# EAGLE schematic Additional cascades (may be useful) (EAGLE 9.5.1)
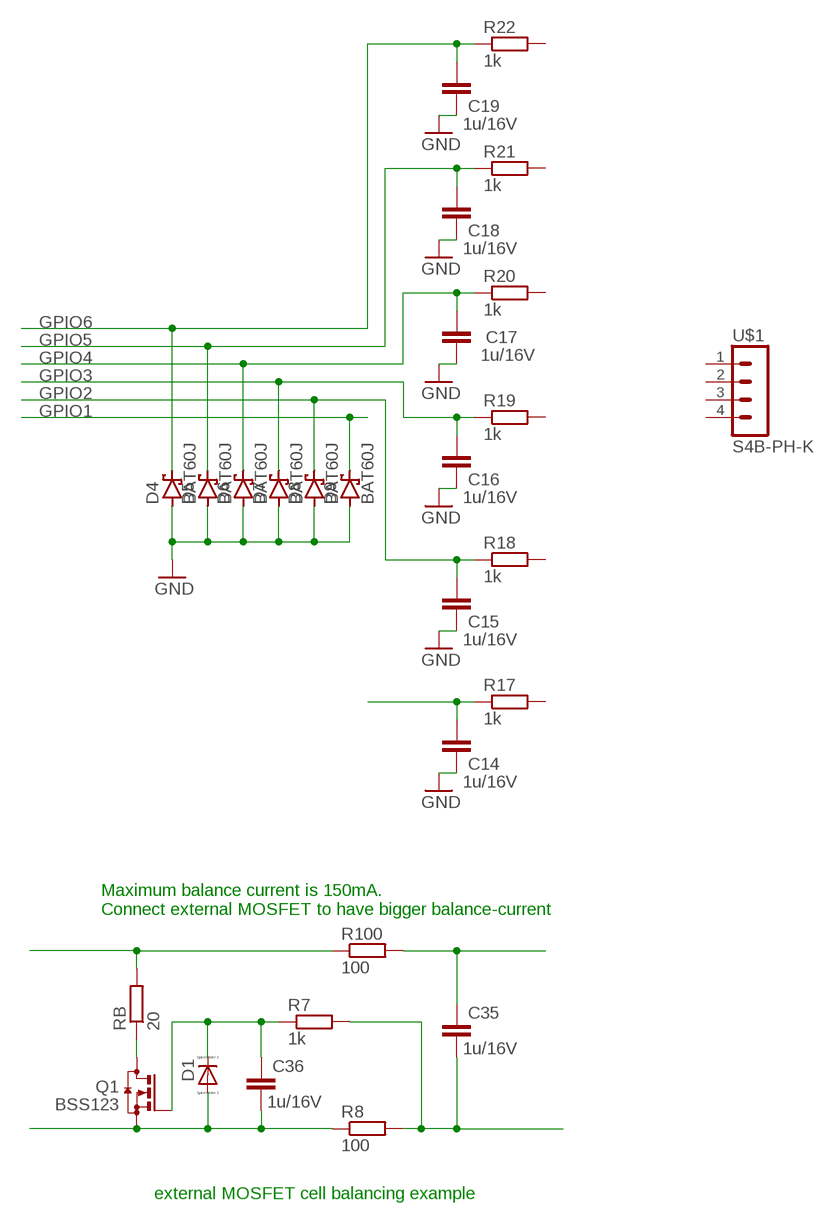
[diagram p0: schematic, sheet 1]

## Parts
C14  1u/16V  C-EUC0603  [C0603]
C15  1u/16V  C-EUC0603  [C0603]
C16  1u/16V  C-EUC0603  [C0603]
C17  1u/16V  C-EUC0603  [C0603]
C18  1u/16V  C-EUC0603  [C0603]
C19  1u/16V  C-EUC0603  [C0603]
C35  1u/16V  C-EUC0603  [C0603]
C36  1u/16V  C-EUC0603  [C0603]
D1  DIODE_E-  [DIODE_SMB]
D4  BAT60J  [SOD323_ST]
D5  BAT60J  [SOD323_ST]
D6  BAT60J  [SOD323_ST]
D7  BAT60J  [SOD323_ST]
D8  BAT60J  [SOD323_ST]
D9  BAT60J  [SOD323_ST]
Q1  BSS123  [SOT23]
R7  1k  R-EU_R0603  [R0603]
R8  100  R-EU_R0603  [R0603]
R17  1k  R-EU_R0603  [R0603]
R18  1k  R-EU_R0603  [R0603]
R19  1k  R-EU_R0603  [R0603]
R20  1k  R-EU_R0603  [R0603]
R21  1k  R-EU_R0603  [R0603]
R22  1k  R-EU_R0603  [R0603]
R100  100  R-EU_R0603  [R0603]
RB  20  R-EU_R0603  [R0603]
U$1  S4B-PH-K  [S4B-PH-K]

## Nets
GND: C14.1 C15.1 C16.1 C17.1 C18.1 C19.1 D4.A D5.A D6.A D7.A D8.A D9.A
GPIO1: C14.2 D9.C R17.1
GPIO2: C15.2 D8.C R18.1
GPIO3: C16.2 D7.C R19.1
GPIO4: C17.2 D6.C R20.1
GPIO5: C18.2 D5.C R21.1
GPIO6: C19.2 D4.C R22.1
N$41: Q1.3(D) RB.1
N$42: R100.1 RB.2
N$43: C35.2 R100.2
N$44: C35.1 R7.2 R8.2
N$45: C36.1 D1.A(C) Q1.2(S) R8.1
N$46: C36.2 D1.C(A) Q1.1(G) R7.1
Unconnected: R17.2 R18.2 R19.2 R20.2 R21.2 R22.2 U$1.1 U$1.2 U$1.3 U$1.4

## Notes on the sheet
- Maximum balance current is 150mA. 
  Connect external MOSFET to have bigger balance-current
- external MOSFET cell balancing example

## Library data of the parts
C14-C19 C35 C36 = resistor:C-EU: CAPACITOR, European symbol
D1 = eagle-ltspice:DIODE_E-: Schottky Diode; SPICEMODEL: diode; SPICEPREFIX: D
D4-D9 = diode:BAT60J: Schottky barrier diode Source: www.st.com, BAT60J.pdf
Q1 = transistor-small-signal:BSS123: N-CHANNEL MOS FET
R7 R8 R17-R22 R100 RB = resistor:R-EU_: RESISTOR, European symbol
U$1 = con-jst-ph:S4B-PH-K: Wire to board connector Model suitable for S4B-PH-K Updated: 21.10.19 by Andrey Dovnar, andrevdovnar@gmail.com